# Altium schematic sheet LED_Driver_and_LEDs_03.SchDoc
size A
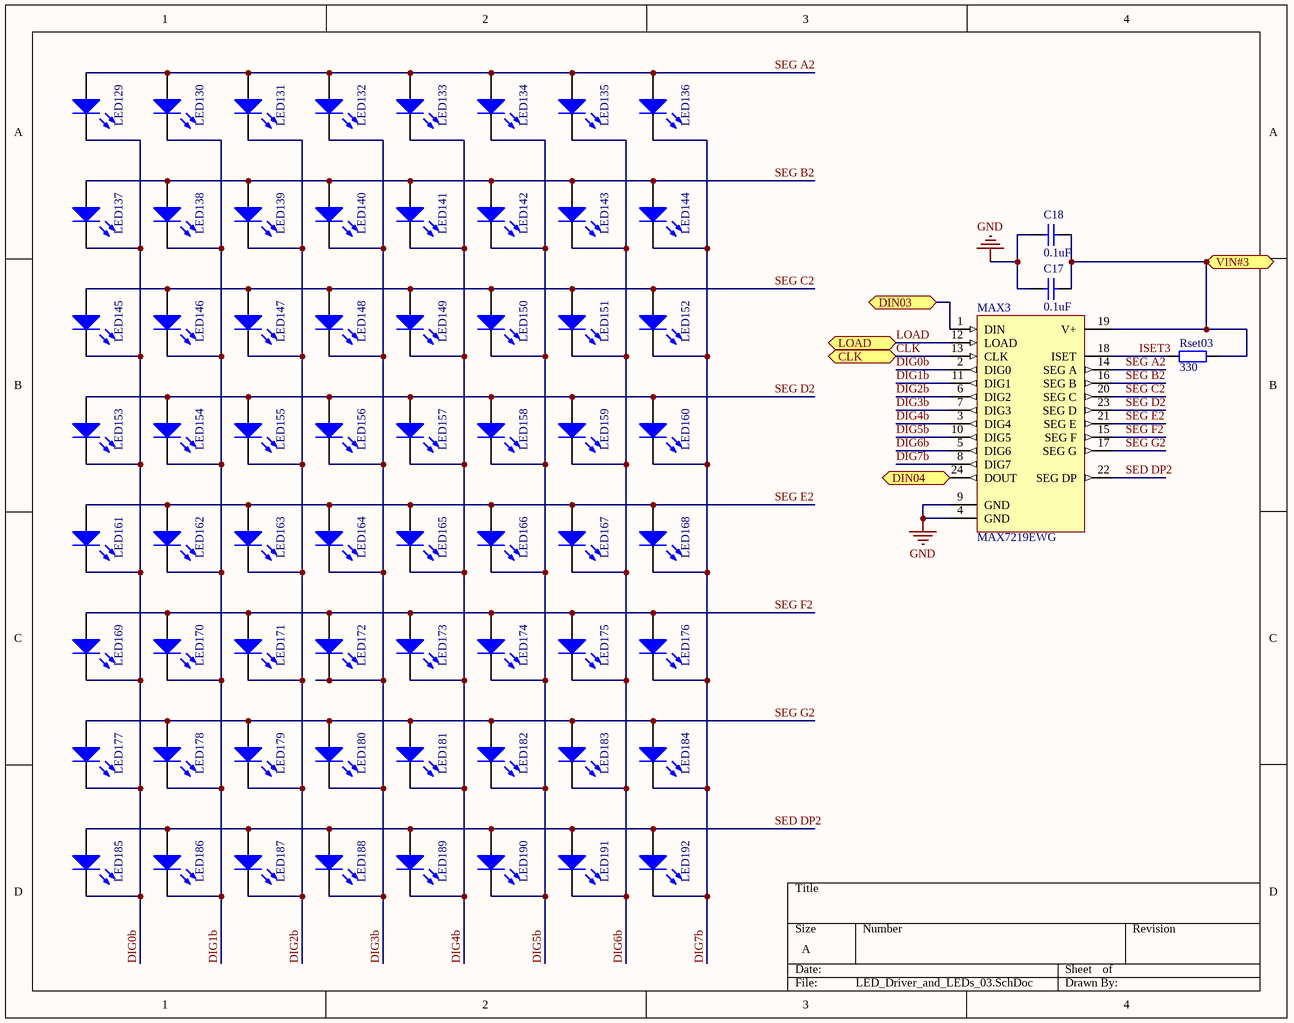
[diagram p0: LED_Driver_and_LEDs_03.SchDoc]

## Parts
C17  value 0.1uF  [6-0805_N]  (hidden comment: Cap Semi)
C18  value 0.1uF  [6-0805_N]  (hidden comment: Cap Semi)
LED129  LED3  [3.5X2.8X1.9]  (value not drawn)
LED130  LED3  [3.5X2.8X1.9]  (value not drawn)
LED131  LED3  [3.5X2.8X1.9]  (value not drawn)
LED132  LED3  [3.5X2.8X1.9]  (value not drawn)
LED133  LED3  [3.5X2.8X1.9]  (value not drawn)
LED134  LED3  [3.5X2.8X1.9]  (value not drawn)
LED135  LED3  [3.5X2.8X1.9]  (value not drawn)
LED136  LED3  [3.5X2.8X1.9]  (value not drawn)
LED137  LED3  [3.5X2.8X1.9]  (value not drawn)
LED138  LED3  [3.5X2.8X1.9]  (value not drawn)
LED139  LED3  [3.5X2.8X1.9]  (value not drawn)
LED140  LED3  [3.5X2.8X1.9]  (value not drawn)
LED141  LED3  [3.5X2.8X1.9]  (value not drawn)
LED142  LED3  [3.5X2.8X1.9]  (value not drawn)
LED143  LED3  [3.5X2.8X1.9]  (value not drawn)
LED144  LED3  [3.5X2.8X1.9]  (value not drawn)
LED145  LED3  [3.5X2.8X1.9]  (value not drawn)
LED146  LED3  [3.5X2.8X1.9]  (value not drawn)
LED147  LED3  [3.5X2.8X1.9]  (value not drawn)
LED148  LED3  [3.5X2.8X1.9]  (value not drawn)
LED149  LED3  [3.5X2.8X1.9]  (value not drawn)
LED150  LED3  [3.5X2.8X1.9]  (value not drawn)
LED151  LED3  [3.5X2.8X1.9]  (value not drawn)
LED152  LED3  [3.5X2.8X1.9]  (value not drawn)
LED153  LED3  [3.5X2.8X1.9]  (value not drawn)
LED154  LED3  [3.5X2.8X1.9]  (value not drawn)
LED155  LED3  [3.5X2.8X1.9]  (value not drawn)
LED156  LED3  [3.5X2.8X1.9]  (value not drawn)
LED157  LED3  [3.5X2.8X1.9]  (value not drawn)
LED158  LED3  [3.5X2.8X1.9]  (value not drawn)
LED159  LED3  [3.5X2.8X1.9]  (value not drawn)
LED160  LED3  [3.5X2.8X1.9]  (value not drawn)
LED161  LED3  [3.5X2.8X1.9]  (value not drawn)
LED162  LED3  [3.5X2.8X1.9]  (value not drawn)
LED163  LED3  [3.5X2.8X1.9]  (value not drawn)
LED164  LED3  [3.5X2.8X1.9]  (value not drawn)
LED165  LED3  [3.5X2.8X1.9]  (value not drawn)
LED166  LED3  [3.5X2.8X1.9]  (value not drawn)
LED167  LED3  [3.5X2.8X1.9]  (value not drawn)
LED168  LED3  [3.5X2.8X1.9]  (value not drawn)
LED169  LED3  [3.5X2.8X1.9]  (value not drawn)
LED170  LED3  [3.5X2.8X1.9]  (value not drawn)
LED171  LED3  [3.5X2.8X1.9]  (value not drawn)
LED172  LED3  [3.5X2.8X1.9]  (value not drawn)
LED173  LED3  [3.5X2.8X1.9]  (value not drawn)
LED174  LED3  [3.5X2.8X1.9]  (value not drawn)
LED175  LED3  [3.5X2.8X1.9]  (value not drawn)
LED176  LED3  [3.5X2.8X1.9]  (value not drawn)
LED177  LED3  [3.5X2.8X1.9]  (value not drawn)
LED178  LED3  [3.5X2.8X1.9]  (value not drawn)
LED179  LED3  [3.5X2.8X1.9]  (value not drawn)
LED180  LED3  [3.5X2.8X1.9]  (value not drawn)
LED181  LED3  [3.5X2.8X1.9]  (value not drawn)
LED182  LED3  [3.5X2.8X1.9]  (value not drawn)
LED183  LED3  [3.5X2.8X1.9]  (value not drawn)
LED184  LED3  [3.5X2.8X1.9]  (value not drawn)
LED185  LED3  [3.5X2.8X1.9]  (value not drawn)
LED186  LED3  [3.5X2.8X1.9]  (value not drawn)
LED187  LED3  [3.5X2.8X1.9]  (value not drawn)
LED188  LED3  [3.5X2.8X1.9]  (value not drawn)
LED189  LED3  [3.5X2.8X1.9]  (value not drawn)
LED190  LED3  [3.5X2.8X1.9]  (value not drawn)
LED191  LED3  [3.5X2.8X1.9]  (value not drawn)
LED192  LED3  [3.5X2.8X1.9]  (value not drawn)
MAX3  MAX7219EWG  [WSO24_N]
Rset03  value 330  [J1-0603]  (hidden comment: Res2)

## Ports
CLK (bidir), DIN03 (bidir), DIN04 (out), LOAD (bidir), VIN#3 (in)

## Nets
GND: C17.2 C18.2 MAX3.4(GND) MAX3.9(GND)
CLK: MAX3.13(CLK) ; port CLK
DIG0b: LED129.2(K) LED137.2(K) LED145.2(K) LED153.2(K) LED161.2(K) LED169.2(K) LED177.2(K) LED185.2(K) MAX3.2(DIG0)
DIG1b: LED130.2(K) LED138.2(K) LED146.2(K) LED154.2(K) LED162.2(K) LED170.2(K) LED178.2(K) LED186.2(K) MAX3.11(DIG1)
DIG2b: LED131.2(K) LED139.2(K) LED147.2(K) LED155.2(K) LED163.2(K) LED171.2(K) LED179.2(K) LED187.2(K) MAX3.6(DIG2)
DIG3b: LED132.2(K) LED140.2(K) LED148.2(K) LED156.2(K) LED164.2(K) LED172.2(K) LED180.2(K) LED188.2(K) MAX3.7(DIG3)
DIG4b: LED133.2(K) LED141.2(K) LED149.2(K) LED157.2(K) LED165.2(K) LED173.2(K) LED181.2(K) LED189.2(K) MAX3.3(DIG4)
DIG5b: LED134.2(K) LED142.2(K) LED150.2(K) LED158.2(K) LED166.2(K) LED174.2(K) LED182.2(K) LED190.2(K) MAX3.10(DIG5)
DIG6b: LED135.2(K) LED143.2(K) LED151.2(K) LED159.2(K) LED167.2(K) LED175.2(K) LED183.2(K) LED191.2(K) MAX3.5(DIG6)
DIG7b: LED136.2(K) LED144.2(K) LED152.2(K) LED160.2(K) LED168.2(K) LED176.2(K) LED184.2(K) LED192.2(K) MAX3.8(DIG7)
DIN03: MAX3.1(DIN) ; port DIN03
DIN04: MAX3.24(DOUT) ; port DIN04
ISET3: MAX3.18(ISET) Rset03.2
LOAD: MAX3.12(LOAD) ; port LOAD
SED DP2: LED185.1(A) LED186.1(A) LED187.1(A) LED188.1(A) LED189.1(A) LED190.1(A) LED191.1(A) LED192.1(A) MAX3.22(SEG_DP)
SEG A2: LED129.1(A) LED130.1(A) LED131.1(A) LED132.1(A) LED133.1(A) LED134.1(A) LED135.1(A) LED136.1(A) MAX3.14(SEG_A)
SEG B2: LED137.1(A) LED138.1(A) LED139.1(A) LED140.1(A) LED141.1(A) LED142.1(A) LED143.1(A) LED144.1(A) MAX3.16(SEG_B)
SEG C2: LED145.1(A) LED146.1(A) LED147.1(A) LED148.1(A) LED149.1(A) LED150.1(A) LED151.1(A) LED152.1(A) MAX3.20(SEG_C)
SEG D2: LED153.1(A) LED154.1(A) LED155.1(A) LED156.1(A) LED157.1(A) LED158.1(A) LED159.1(A) LED160.1(A) MAX3.23(SEG_D)
SEG E2: LED161.1(A) LED162.1(A) LED163.1(A) LED164.1(A) LED165.1(A) LED166.1(A) LED167.1(A) LED168.1(A) MAX3.21(SEG_E)
SEG F2: LED169.1(A) LED170.1(A) LED171.1(A) LED172.1(A) LED173.1(A) LED174.1(A) LED175.1(A) LED176.1(A) MAX3.15(SEG_F)
SEG G2: LED177.1(A) LED178.1(A) LED179.1(A) LED180.1(A) LED181.1(A) LED182.1(A) LED183.1(A) LED184.1(A) MAX3.17(SEG_G)
VIN#3: C17.1 C18.1 MAX3.19(V+) Rset03.1 ; port VIN#3

## Library data of the parts
C17 C18 = Cap Semi: Capacitor (Semiconductor SIM Model); Published: 8-Jun-2000; LatestRevisionDate: 29-May-2009; LatestRevisionNote: IPC-7351 Footprint Added.; PackageReference: C1206; Publisher: Altium Limited; PackageDescription: Chip Capacitor
LED129-LED192 = LED3: Typical BLUE SiC LED; Published: 8-Jun-2000; LatestRevisionDate: 17-Dec-2003; LatestRevisionNote: PCB Footprint replaced.; DatasheetVersion: 16-Apr-2002; PackageVersion: 16-Apr-2002; PackageReference: 3.5X2.8X1.9; Publisher: Altium Limited; PackageDescription: SM LED; 2 C-Bend Leads; Body 3.5 x 2.8 x 1.9 mm, inc leads (LxWxH typ)
MAX3 = MAX7219EWG: Serially Interfaced, 8-Digit LED Display Driver; Published: 16-Jan-2001; LatestRevisionDate: 13-Apr-2006; LatestRevisionNote: IPC-7351 Footprint Added.; DatasheetVersion: Jul-1997; PackageReference: WSO24; Publisher: Altium Limited; PackageDescription: 24-Pin Small Outline Integrated Circuit 1.27 mm Pitch; ComponentLink1Description: Manufacturer Link; ComponentLink1URL: http://www.maxim-ic.com/; ComponentLink2Description: Datasheet; ComponentLink2URL: http://pdfserv.maxim-ic.com/en/ds/MAX7219-MAX7221.pdf
Rset03 = Res2: Resistor; Published: 8-Jun-2000; LatestRevisionDate: 17-Jul-2002; LatestRevisionNote: Re-released for DXP Platform.; PackageReference: AXIAL-0.4; Publisher: Altium Limited; PackageDescription: Axial Device, Thru-Hole; 2 Leads; 0.4 in Pin Spacing